# EAGLE schematic LE910_eval_0 (EAGLE 7.7.0)

## Sheet 1 of 4
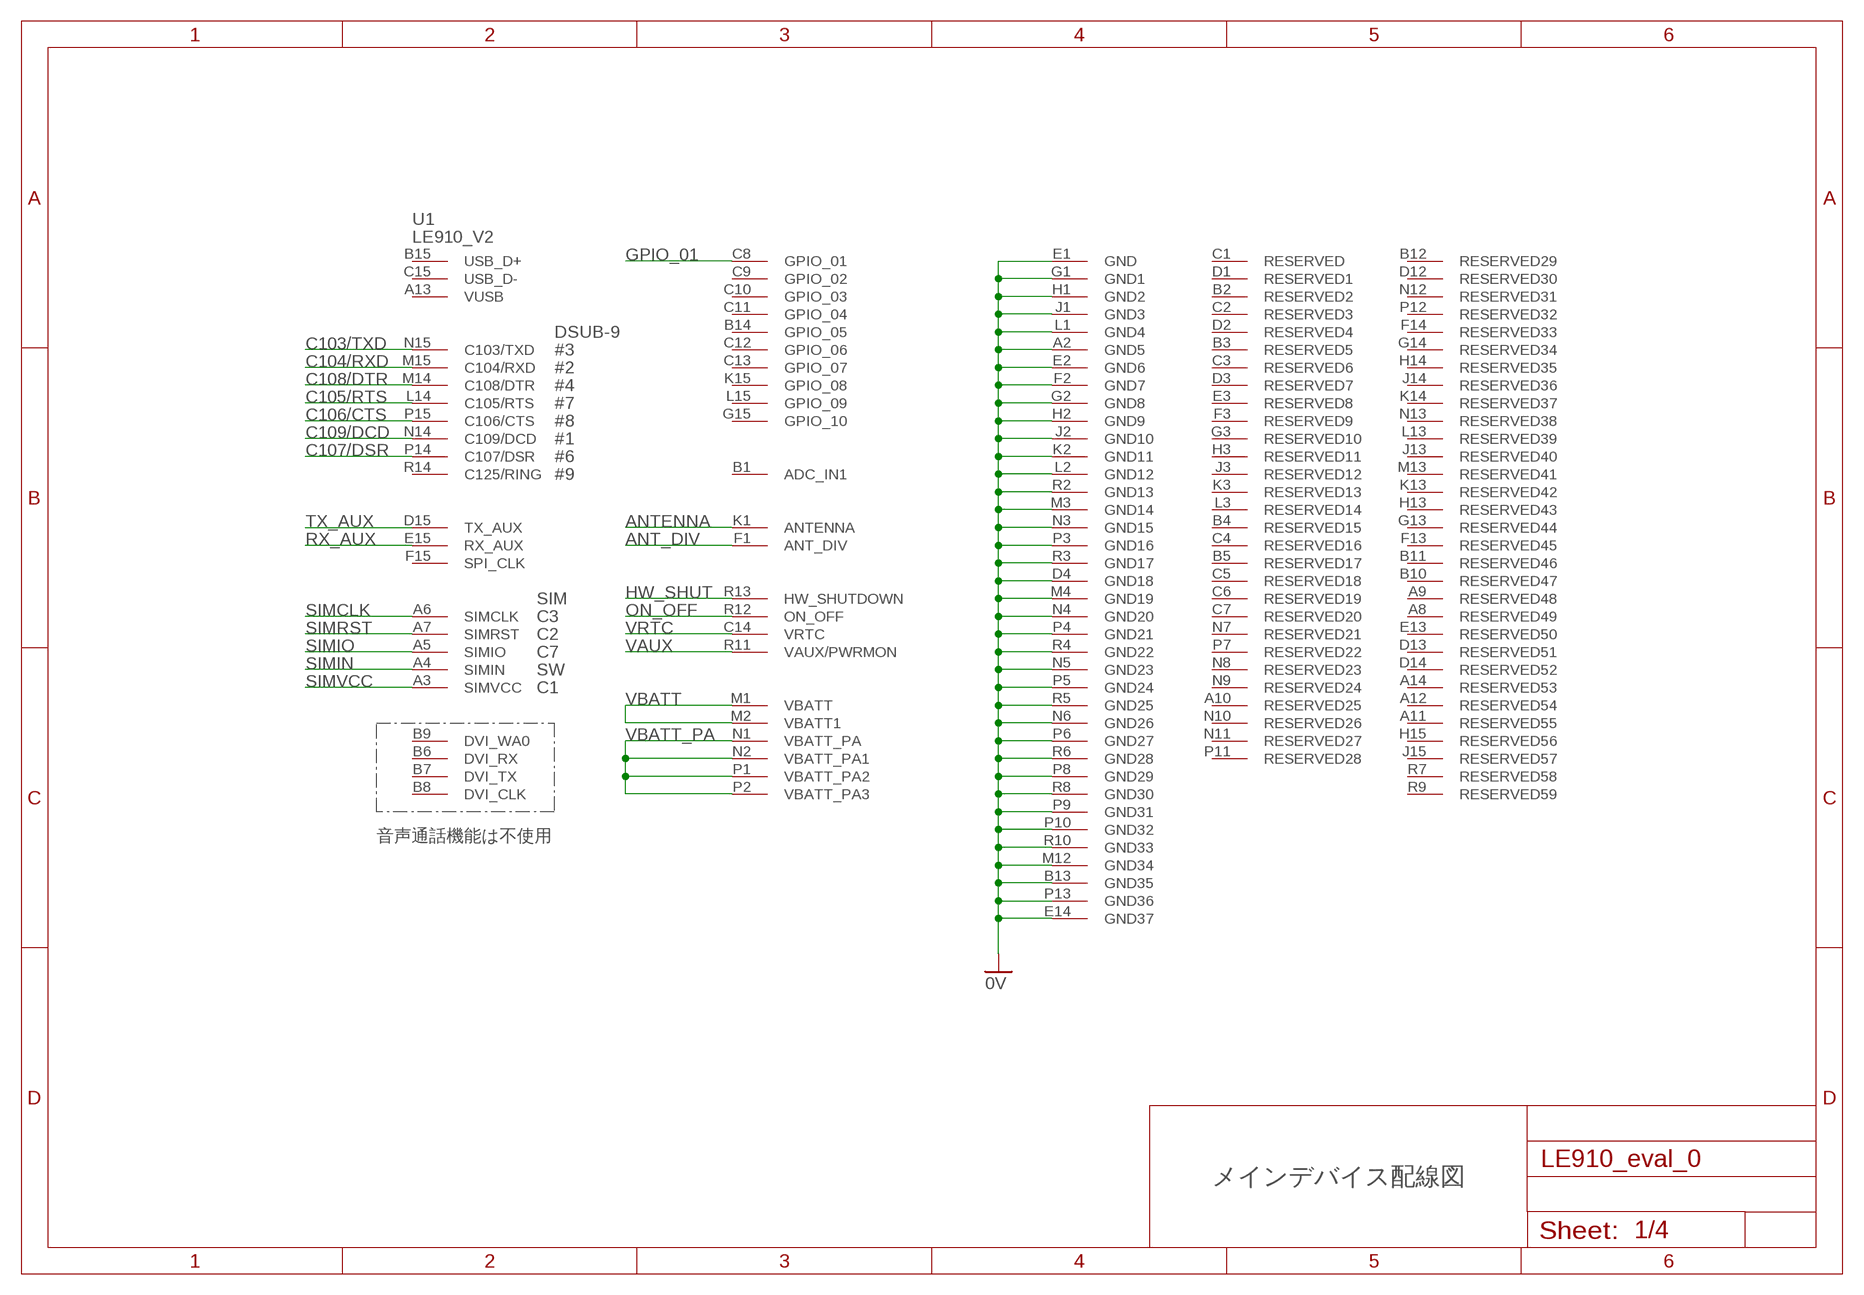
[diagram p0: schematic, sheet 1]

### Parts
U1  LE910_V2  [LE910_V2]

### Nets
0V: U1.A2(GND5) U1.B13(GND35) U1.D4(GND18) U1.E1(GND) U1.E2(GND6) U1.E14(GND37) U1.F2(GND7) U1.G1(GND1) U1.G2(GND8) U1.H1(GND2) U1.H2(GND9) U1.J1(GND3) U1.J2(GND10) U1.K2(GND11) U1.L1(GND4) U1.L2(GND12) U1.M3(GND14) U1.M4(GND19) U1.M12(GND34) U1.N3(GND15) U1.N4(GND20) U1.N5(GND23) U1.N6(GND26) U1.P3(GND16) U1.P4(GND21) U1.P5(GND24) U1.P6(GND27) U1.P8(GND29) U1.P9(GND31) U1.P10(GND32) U1.P13(GND36) U1.R2(GND13) U1.R3(GND17) U1.R4(GND22) U1.R5(GND25) U1.R6(GND28) U1.R8(GND30) U1.R10(GND33) ; also sheet 2,3,4
ANT_DIV: U1.F1(ANT_DIV) ; also sheet 3
ANTENNA: U1.K1(ANTENNA) ; also sheet 3
C103/TXD: U1.N15(C103/TXD) ; also sheet 3
C104/RXD: U1.M15(C104/RXD) ; also sheet 3
C105/RTS: U1.L14(C105/RTS) ; also sheet 3
C106/CTS: U1.P15(C106/CTS) ; also sheet 3
C107/DSR: U1.P14(C107/DSR) ; also sheet 3
C108/DTR: U1.M14(C108/DTR) ; also sheet 3
C109/DCD: U1.N14(C109/DCD) ; also sheet 3
GPIO_01: U1.C8(GPIO_01) ; also sheet 4
HW_SHUT: U1.R13(HW_SHUTDOWN) ; also sheet 4
ON_OFF: U1.R12(ON_OFF) ; also sheet 4
RX_AUX: U1.E15(RX_AUX) ; also sheet 3
SIMCLK: U1.A6(SIMCLK) ; also sheet 3
SIMIN: U1.A4(SIMIN) ; also sheet 3
SIMIO: U1.A5(SIMIO) ; also sheet 3
SIMRST: U1.A7(SIMRST) ; also sheet 3
SIMVCC: U1.A3(SIMVCC) ; also sheet 3
TX_AUX: U1.D15(TX_AUX) ; also sheet 3
VAUX: U1.R11(VAUX/PWRMON) ; also sheet 2,4
VBATT: U1.M1(VBATT) U1.M2(VBATT1) ; also sheet 2
VBATT_PA: U1.N1(VBATT_PA) U1.N2(VBATT_PA1) U1.P1(VBATT_PA2) U1.P2(VBATT_PA3) ; also sheet 2
VRTC: U1.C14(VRTC) ; also sheet 2
Unconnected: U1.A8(RESERVED49) U1.A9(RESERVED48) U1.A10(RESERVED25) U1.A11(RESERVED55) U1.A12(RESERVED54) U1.A13(VUSB) U1.A14(RESERVED53) U1.B1(ADC_IN1) U1.B2(RESERVED2) U1.B3(RESERVED5) U1.B4(RESERVED15) U1.B5(RESERVED17) U1.B6(DVI_RX) U1.B7(DVI_TX) U1.B8(DVI_CLK) U1.B9(DVI_WA0) U1.B10(RESERVED47) U1.B11(RESERVED46) U1.B12(RESERVED29) U1.B14(GPIO_05) U1.B15(USB_D+) U1.C1(RESERVED) U1.C2(RESERVED3) U1.C3(RESERVED6) U1.C4(RESERVED16) U1.C5(RESERVED18) U1.C6(RESERVED19) U1.C7(RESERVED20) U1.C9(GPIO_02) U1.C10(GPIO_03) U1.C11(GPIO_04) U1.C12(GPIO_06) U1.C13(GPIO_07) U1.C15(USB_D-) U1.D1(RESERVED1) U1.D2(RESERVED4) U1.D3(RESERVED7) U1.D12(RESERVED30) U1.D13(RESERVED51) U1.D14(RESERVED52) U1.E3(RESERVED8) U1.E13(RESERVED50) U1.F3(RESERVED9) U1.F13(RESERVED45) U1.F14(RESERVED33) U1.F15(SPI_CLK) U1.G3(RESERVED10) U1.G13(RESERVED44) U1.G14(RESERVED34) U1.G15(GPIO_10) U1.H3(RESERVED11) U1.H13(RESERVED43) U1.H14(RESERVED35) U1.H15(RESERVED56) U1.J3(RESERVED12) U1.J13(RESERVED40) U1.J14(RESERVED36) U1.J15(RESERVED57) U1.K3(RESERVED13) U1.K13(RESERVED42) U1.K14(RESERVED37) U1.K15(GPIO_08) U1.L3(RESERVED14) U1.L13(RESERVED39) U1.L15(GPIO_09) U1.M13(RESERVED41) U1.N7(RESERVED21) U1.N8(RESERVED23) U1.N9(RESERVED24) U1.N10(RESERVED26) U1.N11(RESERVED27) U1.N12(RESERVED31) U1.N13(RESERVED38) U1.P7(RESERVED22) U1.P11(RESERVED28) U1.P12(RESERVED32) U1.R7(RESERVED58) U1.R9(RESERVED59) U1.R14(C125/RING)

### Notes on the sheet
- DSUB-9
- #3
- #2
- #4
- #7
- #8
- #1
- #6
- #9
- SIM
- C3
- C2
- C7
- SW
- C1
- 音声通話機能は不使用
- メインデバイス配線図

## Sheet 2 of 4
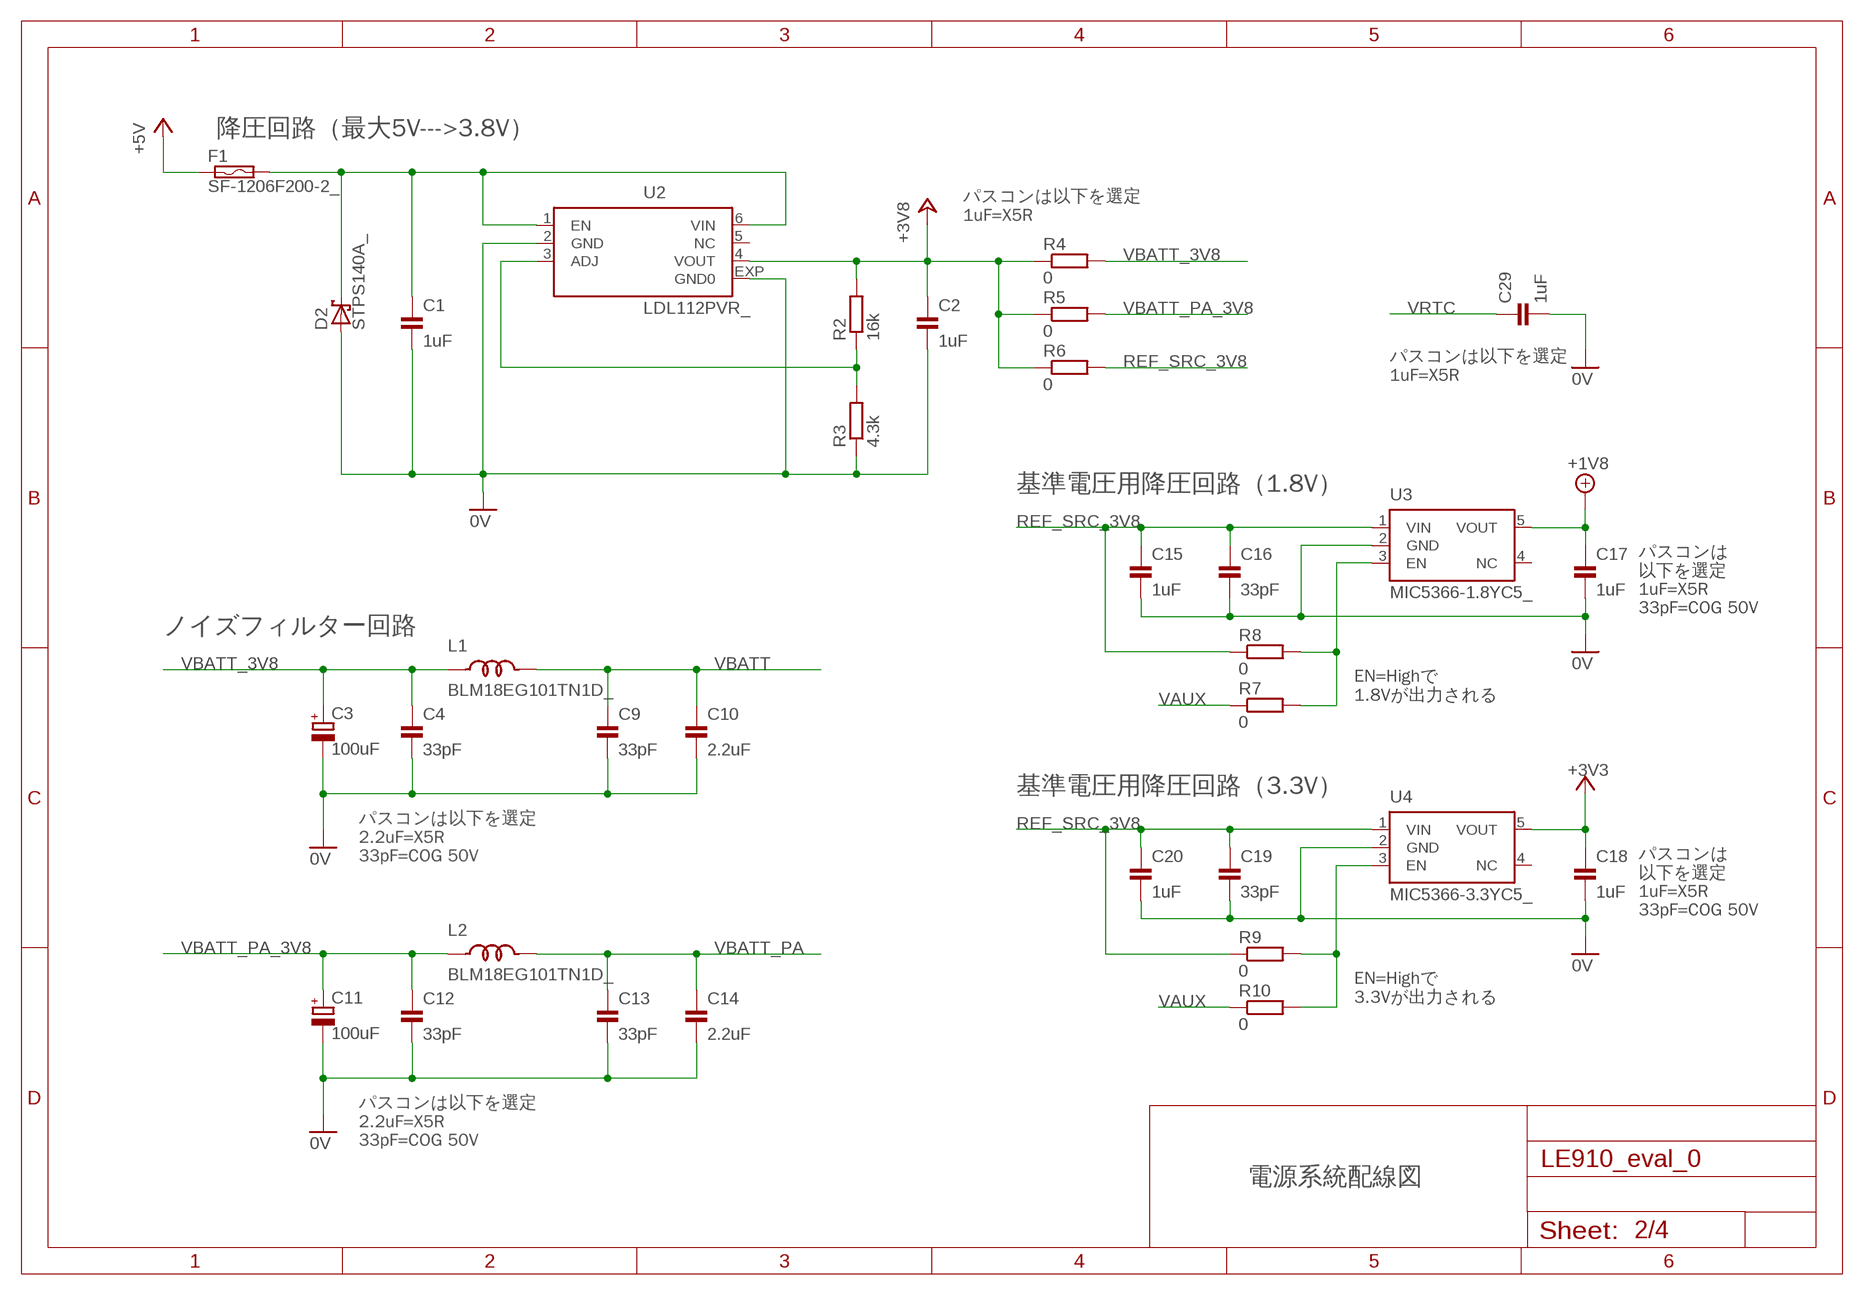
[diagram p1: schematic, sheet 2]

### Parts
C1  1uF  CAP_0603_DEV  [SMD_1608_DEV]
C2  1uF  CAP_0603_DEV  [SMD_1608_DEV]
C3  100uF  TPSW107K006R0150  [CT6032]
C4  33pF  CAP_0603_DEV  [SMD_1608_DEV]
C9  33pF  CAP_0603_DEV  [SMD_1608_DEV]
C10  2.2uF  CAP_0603_DEV  [SMD_1608_DEV]
C11  100uF  TPSW107K006R0150  [CT6032]
C12  33pF  CAP_0603_DEV  [SMD_1608_DEV]
C13  33pF  CAP_0603_DEV  [SMD_1608_DEV]
C14  2.2uF  CAP_0603_DEV  [SMD_1608_DEV]
C15  1uF  CAP_0603_DEV  [SMD_1608_DEV]
C16  33pF  CAP_0603_DEV  [SMD_1608_DEV]
C17  1uF  CAP_0603_DEV  [SMD_1608_DEV]
C18  1uF  CAP_0603_DEV  [SMD_1608_DEV]
C19  33pF  CAP_0603_DEV  [SMD_1608_DEV]
C20  1uF  CAP_0603_DEV  [SMD_1608_DEV]
C29  1uF  CAP_0603_DEV  [SMD_1608_DEV]
D2  STPS140A_  [SMA_DEV]
F1  SF-1206F200-2_  [SF-1206F_DEV]
L1  BLM18EG101TN1D_  [SMD_1608_DEV]
L2  BLM18EG101TN1D_  [SMD_1608_DEV]
R2  16k  RESISTOR_0603_DEV  [SMD_1608_DEV]
R3  4.3k  RESISTOR_0603_DEV  [SMD_1608_DEV]
R4  0  RESISTOR_0603_DEV  [SMD_1608_DEV]
R5  0  RESISTOR_0603_DEV  [SMD_1608_DEV]
R6  0  RESISTOR_0603_DEV  [SMD_1608_DEV]
R7  0  RESISTOR_0603_DEV  [SMD_1608_DEV]
R8  0  RESISTOR_0603_DEV  [SMD_1608_DEV]
R9  0  RESISTOR_0603_DEV  [SMD_1608_DEV]
R10  0  RESISTOR_0603_DEV  [SMD_1608_DEV]
U2  LDL112PVR_  [DFN6-3X3_DEV]
U3  MIC5366-1.8YC5_  [SC-70-5_DEV]
U4  MIC5366-3.3YC5_  [SC-70-5_DEV]

### Nets
0V: C1.2 C2.2 C3.- C4.2 C9.2 C10.2 C11.- C12.2 C13.2 C14.2 C15.2 C16.2 C17.2 C18.2 C19.2 C20.2 C29.2 D2.2(A) R3.1 U2.2(GND) U2.EXP(GND0) U3.2(GND) U4.2(GND) ; also sheet 1,3,4
+1V8: C17.1 U3.5(VOUT) ; also sheet 3
+3V3: C18.1 U4.5(VOUT) ; also sheet 3
+3V8: C2.1 R2.2 R4.1 R5.1 R6.1 U2.4(VOUT) ; also sheet 4
+5V: F1.1 ; also sheet 4
N$3: C1.1 D2.1(C) F1.2 U2.1(EN) U2.6(VIN)
N$4: R7.2 R8.2 U3.3(EN)
N$7: R2.1 R3.2 U2.3(ADJ)
N$8: R9.2 R10.2 U4.3(EN)
REF_SRC_3V8: C15.1 C16.1 C19.1 C20.1 R6.2 R8.1 R9.1 U3.1(VIN) U4.1(VIN)
VAUX: R7.1 R10.1 ; also sheet 1,4
VBATT: C9.1 C10.1 L1.2 ; also sheet 1
VBATT_3V8: C3.+ C4.1 L1.1 R4.2
VBATT_PA: C13.1 C14.1 L2.2 ; also sheet 1
VBATT_PA_3V8: C11.+ C12.1 L2.1 R5.2
VRTC: C29.1 ; also sheet 1
Unconnected: U2.5(NC) U3.4(NC) U4.4(NC)

### Notes on the sheet
- 降圧回路（最大5V--->3.8V）
- パスコンは以下を選定
  1uF=X5R
- パスコンは以下を選定
  1uF=X5R
- 基準電圧用降圧回路（1.8V）
- パスコンは
  以下を選定
  1uF=X5R
  33pF=COG 50V
- ノイズフィルター回路
- EN=Highで
  1.8Vが出力される
- 基準電圧用降圧回路（3.3V）
- パスコンは以下を選定
  2.2uF=X5R
  33pF=COG 50V
- パスコンは
  以下を選定
  1uF=X5R
  33pF=COG 50V
- EN=Highで
  3.3Vが出力される
- パスコンは以下を選定
  2.2uF=X5R
  33pF=COG 50V
- 電源系統配線図

## Sheet 3 of 4
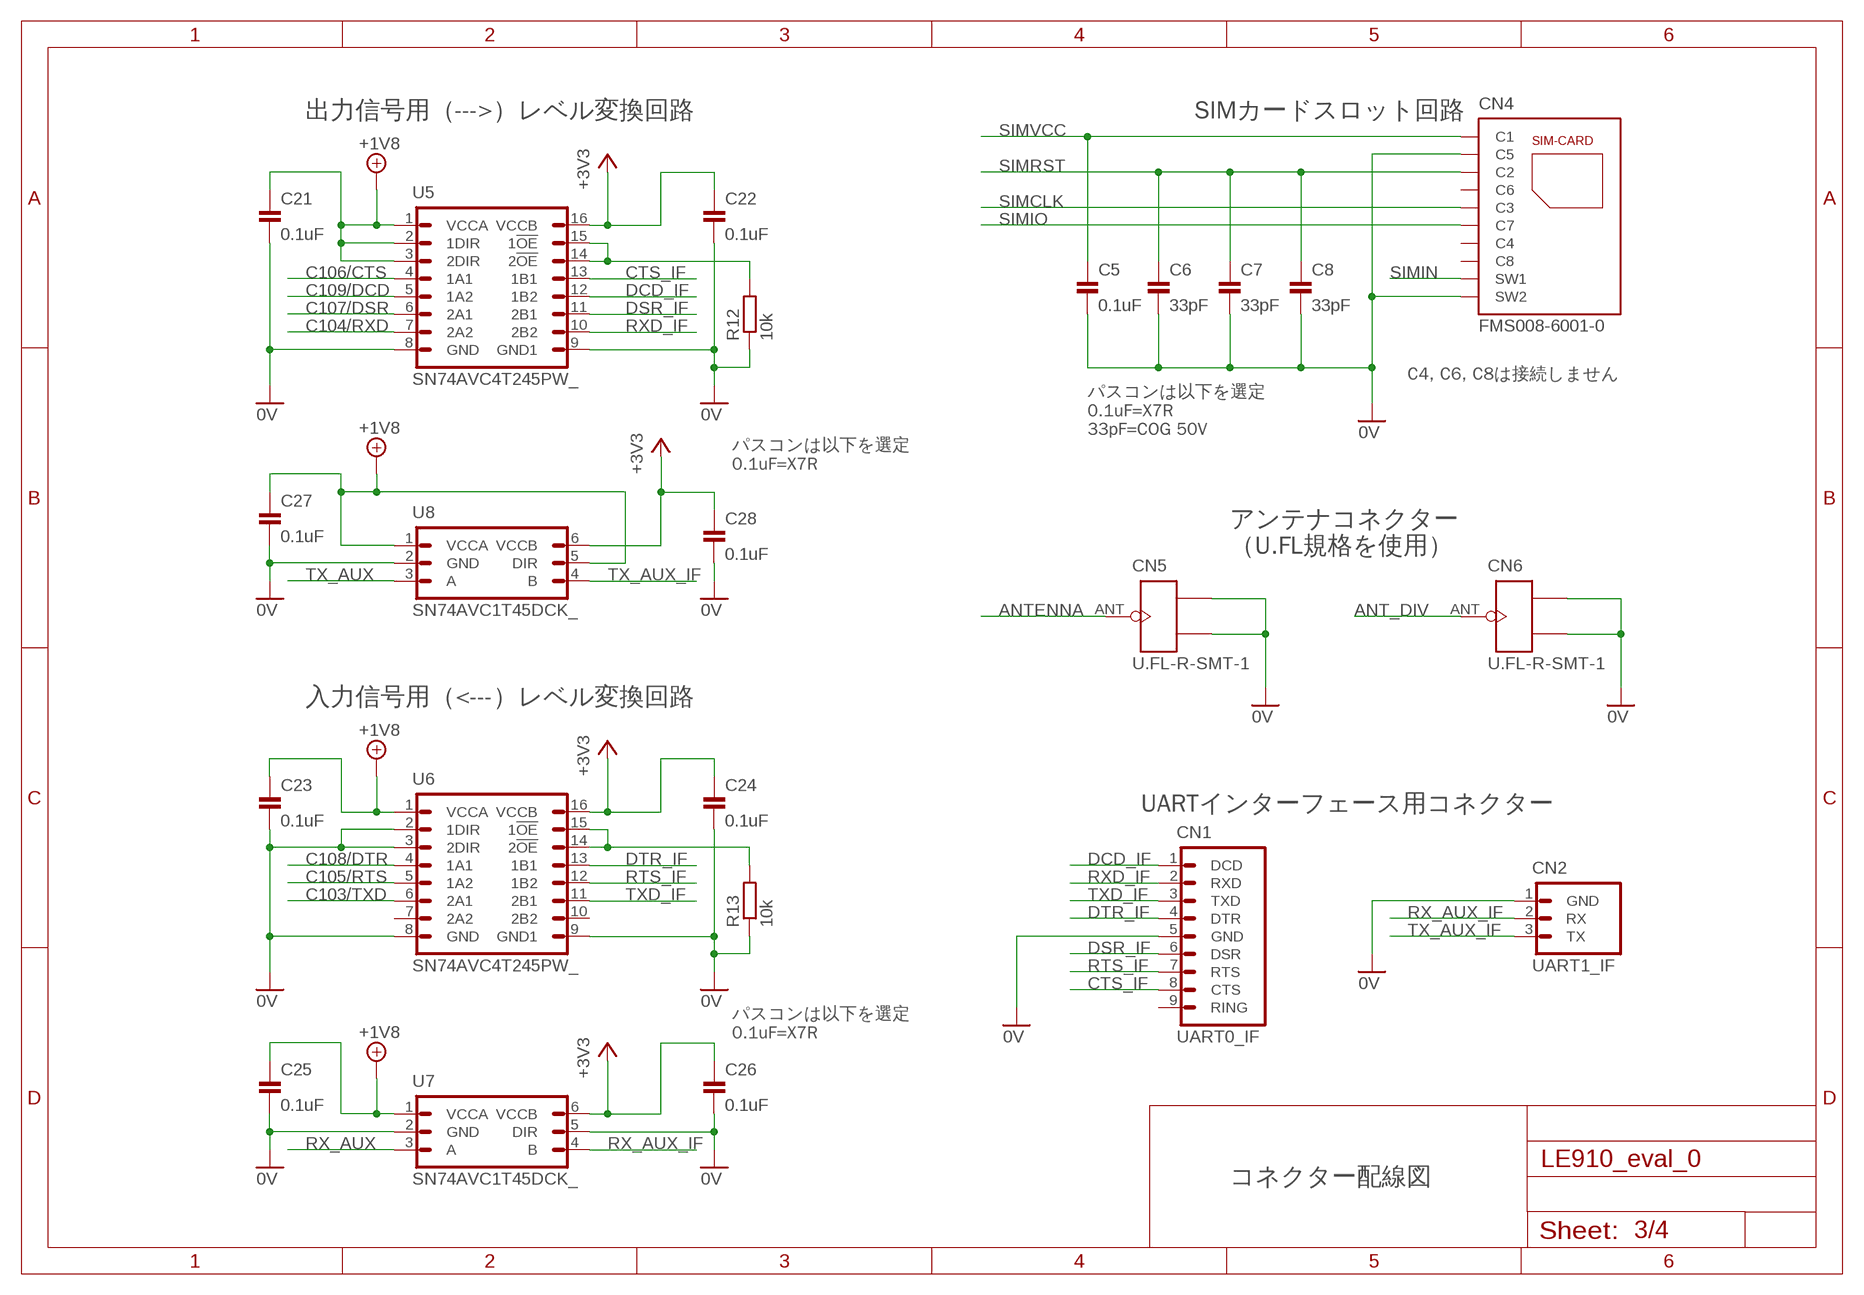
[diagram p2: schematic, sheet 3]

### Parts
C5  0.1uF  CAP_0603_DEV  [SMD_1608_DEV]
C6  33pF  CAP_0603_DEV  [SMD_1608_DEV]
C7  33pF  CAP_0603_DEV  [SMD_1608_DEV]
C8  33pF  CAP_0603_DEV  [SMD_1608_DEV]
C21  0.1uF  CAP_0603_DEV  [SMD_1608_DEV]
C22  0.1uF  CAP_0603_DEV  [SMD_1608_DEV]
C23  0.1uF  CAP_0603_DEV  [SMD_1608_DEV]
C24  0.1uF  CAP_0603_DEV  [SMD_1608_DEV]
C25  0.1uF  CAP_0603_DEV  [SMD_1608_DEV]
C26  0.1uF  CAP_0603_DEV  [SMD_1608_DEV]
C27  0.1uF  CAP_0603_DEV  [SMD_1608_DEV]
C28  0.1uF  CAP_0603_DEV  [SMD_1608_DEV]
CN1  UART0_IF  RS_232C_IF  [RS_232C_IF_9PIN]
CN2  UART1_IF  UART_IF  [UART_IF_3PIN]
CN4  FMS008-6001-0  [FMS008-6001-0]
CN5  U.FL-R-SMT-1  [U.FL-R-SMT-1]
CN6  U.FL-R-SMT-1  [U.FL-R-SMT-1]
R12  10k  RESISTOR_0603_DEV  [SMD_1608_DEV]
R13  10k  RESISTOR_0603_DEV  [SMD_1608_DEV]
U5  SN74AVC4T245PW_  [TSSOP-16_DEV]
U6  SN74AVC4T245PW_  [TSSOP-16_DEV]
U7  SN74AVC1T45DCK_  [SC-70-6_DEV]
U8  SN74AVC1T45DCK_  [SC-70-6_DEV]

### Nets
0V: C5.2 C6.2 C7.2 C8.2 C21.2 C22.2 C23.2 C24.2 C25.2 C26.2 C27.2 C28.2 CN1.5(GND) CN2.1(GND) CN4.C5 CN4.SW2 CN5.GND1 CN5.GND2 CN6.GND1 CN6.GND2 R12.1 R13.1 U5.8(GND) U5.9(GND1) U6.2(1DIR) U6.3(2DIR) U6.8(GND) U6.9(GND1) U7.2(GND) U7.5(DIR) U8.2(GND) ; also sheet 1,2,4
+1V8: C21.1 C23.1 C25.1 C27.1 U5.1(VCCA) U5.2(1DIR) U5.3(2DIR) U6.1(VCCA) U7.1(VCCA) U8.1(VCCA) U8.5(DIR) ; also sheet 2
+3V3: C22.1 C24.1 C26.1 C28.1 U5.16(VCCB) U6.16(VCCB) U7.6(VCCB) U8.6(VCCB) ; also sheet 2
ANT_DIV: CN6.ANT ; also sheet 1
ANTENNA: CN5.ANT ; also sheet 1
C103/TXD: U6.6(2A1) ; also sheet 1
C104/RXD: U5.7(2A2) ; also sheet 1
C105/RTS: U6.5(1A2) ; also sheet 1
C106/CTS: U5.4(1A1) ; also sheet 1
C107/DSR: U5.6(2A1) ; also sheet 1
C108/DTR: U6.4(1A1) ; also sheet 1
C109/DCD: U5.5(1A2) ; also sheet 1
CTS_IF: CN1.8(CTS) U5.13(1B1) ; also sheet 4
DCD_IF: CN1.1(DCD) U5.12(1B2)
DSR_IF: CN1.6(DSR) U5.11(2B1)
DTR_IF: CN1.4(DTR) U6.13(1B1) ; also sheet 4
N$9: R13.2 U6.14(2!OE!) U6.15(1!OE!)
N$10: R12.2 U5.14(2!OE!) U5.15(1!OE!)
RTS_IF: CN1.7(RTS) U6.12(1B2) ; also sheet 4
RX_AUX: U7.3(A) ; also sheet 1
RX_AUX_IF: CN2.2(RX) U7.4(B)
RXD_IF: CN1.2(RXD) U5.10(2B2) ; also sheet 4
SIMCLK: CN4.C3 ; also sheet 1
SIMIN: CN4.SW1 ; also sheet 1
SIMIO: CN4.C7 ; also sheet 1
SIMRST: C6.1 C7.1 C8.1 CN4.C2 ; also sheet 1
SIMVCC: C5.1 CN4.C1 ; also sheet 1
TX_AUX: U8.3(A) ; also sheet 1
TX_AUX_IF: CN2.3(TX) U8.4(B)
TXD_IF: CN1.3(TXD) U6.11(2B1) ; also sheet 4
Unconnected: CN1.9(RING) CN4.C4 CN4.C6 CN4.C8 U6.7(2A2) U6.10(2B2)

### Notes on the sheet
- 出力信号用（--->）レベル変換回路 | SIMカードスロット回路
- C4, C6, C8は接続しません
- パスコンは以下を選定
  0.1uF=X7R
  33pF=COG 50V
- パスコンは以下を選定
  0.1uF=X7R
- アンテナコネクター
  （U.FL規格を使用）
- 入力信号用（<---）レベル変換回路
- UARTインターフェース用コネクター
- パスコンは以下を選定
  0.1uF=X7R
- コネクター配線図

## Sheet 4 of 4
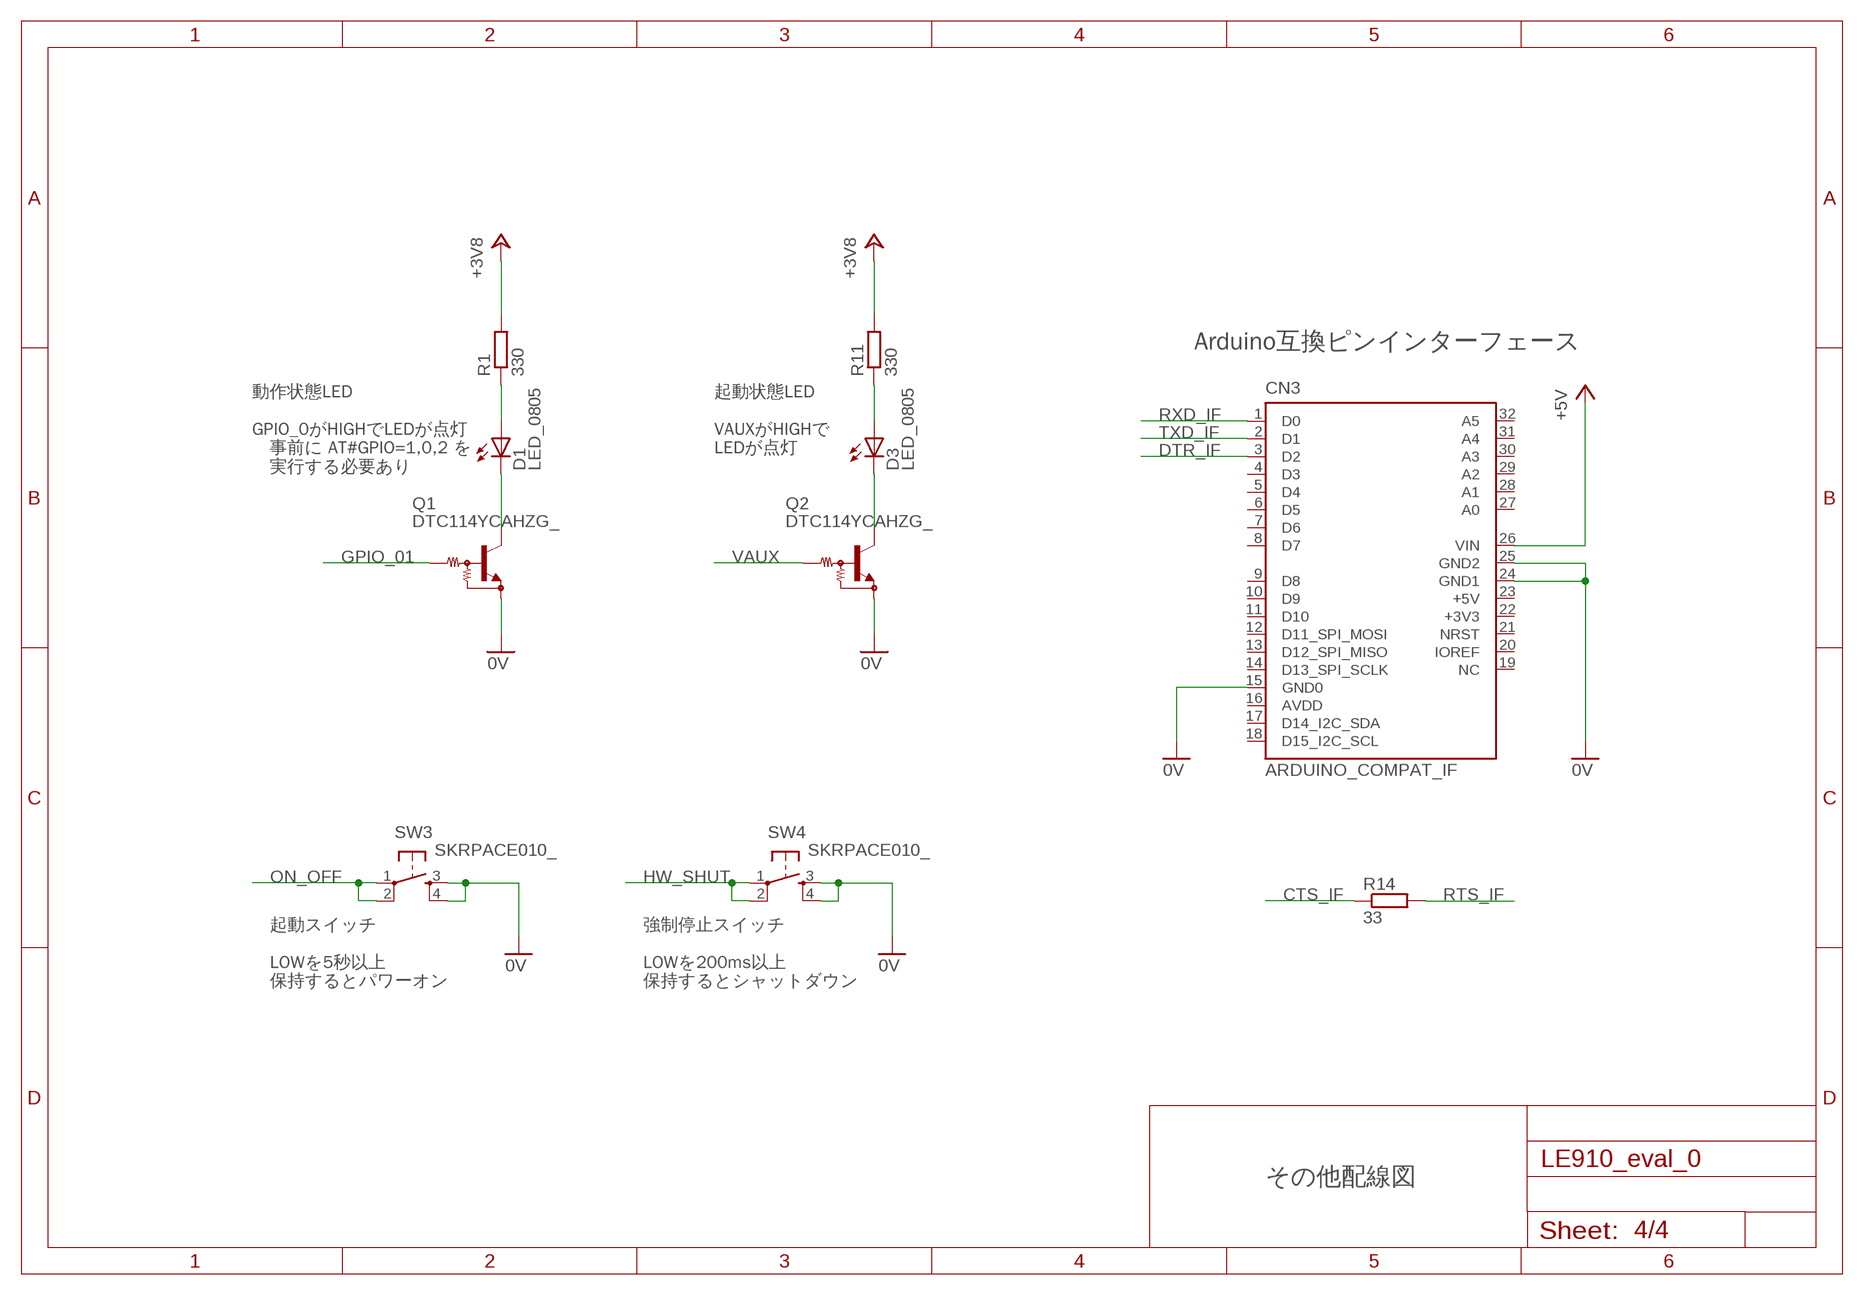
[diagram p3: schematic, sheet 4]

### Parts
CN3  ARDUINO_COMPAT_IF  [ARDUINO_COMPAT_IF]
D1  LED_0805  [CHIPLED_0805]
D3  LED_0805  [CHIPLED_0805]
Q1  DTC114YCAHZG_  [SOT23_DEV]
Q2  DTC114YCAHZG_  [SOT23_DEV]
R1  330  RESISTOR_0603_DEV  [SMD_1608_DEV]
R11  330  RESISTOR_0603_DEV  [SMD_1608_DEV]
R14  33  RESISTOR_0603_DEV  [SMD_1608_DEV]
SW3  SKRPACE010_  [SKRPACE010_DEV]
SW4  SKRPACE010_  [SKRPACE010_DEV]

### Nets
0V: CN3.15(GND0) CN3.24(GND1) CN3.25(GND2) Q1.2(E) Q2.2(E) SW3.3(S) SW3.4(S1) SW4.3(S) SW4.4(S1) ; also sheet 1,2,3
+3V8: R1.2 R11.2 ; also sheet 2
+5V: CN3.26(VIN) ; also sheet 2
CTS_IF: R14.1 ; also sheet 3
DTR_IF: CN3.3(D2) ; also sheet 3
GPIO_01: Q1.1(B) ; also sheet 1
HW_SHUT: SW4.1(P) SW4.2(P1) ; also sheet 1
N$1: D1.C Q1.3(C)
N$2: D3.C Q2.3(C)
N$5: D1.A R1.1
N$6: D3.A R11.1
ON_OFF: SW3.1(P) SW3.2(P1) ; also sheet 1
RTS_IF: R14.2 ; also sheet 3
RXD_IF: CN3.1(D0) ; also sheet 3
TXD_IF: CN3.2(D1) ; also sheet 3
VAUX: Q2.1(B) ; also sheet 1,2
Unconnected: CN3.4(D3) CN3.5(D4) CN3.6(D5) CN3.7(D6) CN3.8(D7) CN3.9(D8) CN3.10(D9) CN3.11(D10) CN3.12(D11_SPI_MOSI) CN3.13(D12_SPI_MISO) CN3.14(D13_SPI_SCLK) CN3.16(AVDD) CN3.17(D14_I2C_SDA) CN3.18(D15_I2C_SCL) CN3.19(NC) CN3.20(IOREF) CN3.21(NRST) CN3.22(+3V3) CN3.23(+5V) CN3.27(A0) CN3.28(A1) CN3.29(A2) CN3.30(A3) CN3.31(A4) CN3.32(A5)

### Notes on the sheet
- Arduino互換ピンインターフェース
- 動作状態LED
  
  GPIO_0がHIGHでLEDが点灯
  　事前に AT#GPIO=1,0,2 を
  　実行する必要あり
- 起動状態LED
  
  VAUXがHIGHで
  LEDが点灯
- 起動スイッチ
  
  LOWを5秒以上
  保持するとパワーオン
- 強制停止スイッチ
  
  LOWを200ms以上
  保持するとシャットダウン
- その他配線図

## Library data of the parts
C1 C2 C4-C10 C12-C29 = Parts:CAP: コンデンサー
C3 C11 = Parts:TPSW: 低ESRタンタルキャパシタ メーカ: AVX
CN1 = PartsForProto:RS_232C_IF: RS-232Cインターフェース
CN2 = PartsForProto:UART_IF: UART インターフェース
CN3 = PartsForProto:ARDUINO_COMPAT_IF: Arduino互換ピンインターフェース
CN4 = Connectors:FMS008-6001-0: 8 Pin SIM Card Reader Push / Push with Switch
CN5 CN6 = Connectors:U.FL-R-SMT-1: U.FL Receptacle
D1 D3 = Parts:LED: 発光ダイオード
D2 = Parts:STPS140: ショットキーダイオード If - 順電流（Forward Current）: 1 A Vrrm - 繰返し逆電圧（Repetitive Reverse Voltage）: 40 V Vf - 順電圧（Forward Voltage）: 0.65 V Ifsm - 順方向サージ電流（Forward Surge Current）: 60 A 最低動作温度: - 65 C 最高動作温度: + 150 C
F1 = Parts:SF-1206F: サーフェイスマウントヒューズ ヒューズ タイプ: Fast Blow 定格電流: 2 A 定格電圧 DC: 63 VDC 最低動作温度: - 20 C 最高動作温度: + 120 C 定格遮断容量: 50 Amps
L1 L2 = Parts:BLM18EG: フェライトビーズ インピーダンス: 100 Ohms 最大 DC 電流: 2 A 最大 DC 抵抗: 45 mOhms 動作温度範囲: - 55 C to + 125 C
Q1 Q2 = Parts:DTC114YCAHZG: バイポーラトランジスタ - プリバイアス トランジスタ極性: NPN 標準入力抵抗: 10 kOhms 標準抵抗比: 4.7 連続コレクタ電流: 100 mA Pd - 電力損失: 200 mW 最高動作温度: + 150 C
R1-R14 = Parts:RESISTOR: 抵抗器
SW3 SW4 = Parts:SKRPACE010: 表面実装用タクトスイッチ ４．２×３．２ｍｍ小型重作動力タイプ ・作動力：２．５５Ｎ ・操作方向：垂直 ・移動量：０．２ｍｍ ・動作寿命：５０，０００ｃｙｃｌｅｓ （５ｍＡ ５ＶＤＣ） ・初期接触抵抗：最大５００ｍΩ
U1 = Modules:LE910_V2: Cellular module
U2 = Parts:LDL112: LDO電圧レギュレータ 出力電流: 1.2 A 入力電圧最大値: 5.5 V 最低動作温度: - 40 C 最高動作温度: + 125 C ドロップアウト電圧: 350 mV
U3 U4 = Parts:MIC5366: LDO電圧レギュレータ 出力電圧: 1.8 V 出力電流: 150 mA 入力電圧最大値: 5.5 V 最低動作温度: - 40 C 最高動作温度: + 125 C ドロップアウト電圧 - 最大: 380 mV
U5 U6 = Parts:SN74AVC4T245: 4-Bit 電圧レベル変換器 伝搬遅延時間: 2.9 ns 供給電圧 - 最大: 3.6 V 供給電圧 - 最小: 1.2 V データ レート: 380 Mb/s 動作温度範囲: - 40 C to + 85 C 出力タイプ: 3-State
U7 U8 = Parts:SN74AVC1T45: 1-Bit 電圧レベル変換器 伝搬遅延時間: 5.6 ns 供給電圧 - 最大: 3.6 V 供給電圧 - 最小: 1.2 V 動作温度範囲: - 40 C to + 85 C 出力タイプ: 3-State